# Altium schematic sheet Energy Harvesting.SchDoc
size A4; Date: 08-06-2023; Engineer: Christian Peppelman; Revision: V400; SheetNumber: 2; SheetTotal: 2; ProjectSheetName: Dental Sensor; SheetName: Energy Harvesting
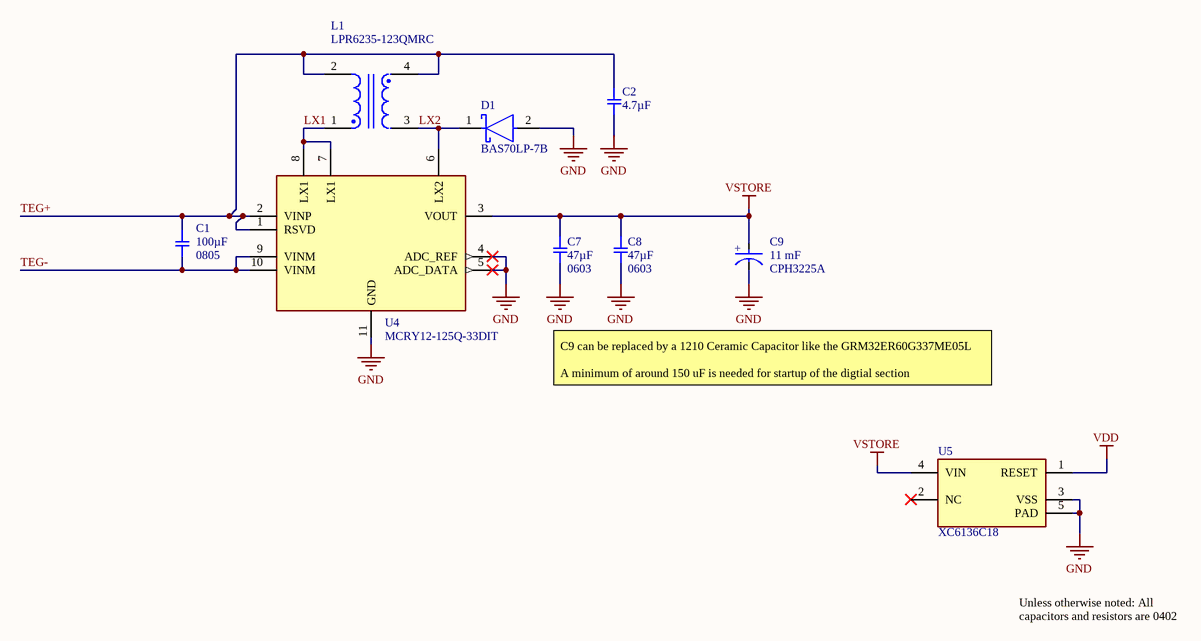
[diagram p0: Energy Harvesting.SchDoc]

## Parts
C1  100µF  Package / Case: 0805  [CAPC2012X12N]
C2  4.7µF  [RESC1005X03N]
C7  47µF  Package / Case: 0603  [CAPC1608X12N]
C8  47µF  Package / Case: 0603  [CAPC1608X12N]
C9  CPH3225A  Capacity: 11 mF  [CPH3225A]
D1  BAS70LP-7B  [FP-X1-DFN1006-2-MFG]
L1  LPR6235-123QMRC  [LPR6235]
U4  MCRY12-125Q-33DIT  [10DFN]
U5  XC6136C18  [USPQ-4B05]

## Nets
GND: C2.2 C7.2 C8.2 C9.2(A) D1.2(A) U4.4(ADC_REF) U4.5(ADC_DATA) U4.11(GND) U5.3(VSS) U5.5(PAD)
VDD: U5.1(RESET)
VSTORE: C7.1 C8.1 C9.1(C) U4.3(VOUT) U5.4(VIN)
LX1: L1.1 U4.7(LX1) U4.8(LX1)
LX2: D1.1(C) L1.3 U4.6(LX2)
TEG+: C1.1 C2.1 L1.2 L1.4 U4.1(RSVD) U4.2(VINP)
TEG-: C1.2 U4.9(VINM) U4.10(VINM)

Not connected (* = marked no-connect by the designer): U5 2(NC)*

## Notes on the sheet
- C9 can be replaced by a 1210 Ceramic Capacitor like the GRM32ER60G337ME05L
  A minimum of around 150 uF is needed for startup of the digtial section
- Unless otherwise noted: All capacitors and resistors are 0402
- Embedded and
- Networked System
- ENGINEER:
- DATE:
- REVISION:
- SIZE: A4
- (in symbol CPH3225A) +

## Library data of the parts
C1 = GRM21BC80E107ME15L: CAP CER 100UF 2.5V X6S 0805; Manufacturer: Murata Electronics North America; Factory Stock: 0; Unit Price (USD): 2.17; Minimum Quantity: 1; Tolerance: ±20%; Datasheets: http://search.murata.co.jp/Ceramy/image/img/A01X/G101/ENG/GRM21BC80E107ME15-01.pdf; Image: //media.digikey.com/Renders/Murata%20Renders/0805%20(2012%20Metric)%20.85mm.jpg; Digi-Key Part Number: 490-13977-1-ND; Part Number: GRM21BC80E107ME15L; Quantity Available: 5990; @ qty: 0; Packaging: Cut Tape (CT); Series: GRM; Part Status: Active; Value: 100µF; Voltage: 2.5V; Temperature Coefficient: X6S; Operating Temperature: -55°C ~ 105°C; Features: -; Ratings: -; Applications: General Purpose; Mounting Type: Surface Mount, MLCC; Size / Dimension: 0.079" L x 0.049" W (2.00mm x 1.25mm); Height - Seated (Max): -; Thickness (Max): 0.057" (1.45mm); Lead Spacing: -; Lead Style: -
C2 = GRM155R60J475ME87D: CAP CER 4.7UF 6.3V X5R 0402; Manufacturer: Murata Electronics North America; Factory Stock: 0; Unit Price (USD): 0.14; Minimum Quantity: 1; Tolerance: ±20%; Datasheets: http://www.murata.com/~/media/webrenewal/support/library/catalog/products/capacitor/mlcc/c02e.pdf; Image: //media.digikey.com/Renders/Murata%20Renders/ZRB-SERIES-0402.jpg; Digi-Key Part Number: 490-5408-1-ND; Part Number: GRM155R60J475ME87D; Quantity Available: 226483; @ qty: 0; Packaging: Cut Tape (CT); Series: GRM; Part Status: Active; Value: 4.7µF; Voltage: 6.3V; Temperature Coefficient: X5R; Operating Temperature: -55°C ~ 85°C; Features: Derating Recommended; Ratings: -; Applications: General Purpose; Mounting Type: Surface Mount, MLCC; Package / Case: 0402 (1005 Metric); Size / Dimension: 0.039" L x 0.020" W (1.00mm x 0.50mm); Height - Seated (Max): -; Thickness (Max): 0.022" (0.55mm); Lead Spacing: -; Lead Style: -
C7 C8 = GRJ155R60J106ME11D: CAP CER 47UF 6.3V X5R 0603; Manufacturer: Murata Electronics North America; Factory Stock: 0; Unit Price (USD): 0.23; Minimum Quantity: 1; Tolerance: ±20%; Datasheets: http://psearch.en.murata.com/capacitor/product/GRJ155R60J106ME11%23.pdf; Image: //media.digikey.com/Renders/Murata%20Renders/ZRB-SERIES-0402.jpg; Digi-Key Part Number: 490-13211-1-ND; Part Number: GRJ155R60J106ME11D; Quantity Available: 64064; @ qty: 0; Packaging: Cut Tape (CT); Series: GRJ; Part Status: Active; Value: 47µF; Voltage: 6.3V; Temperature Coefficient: X5R; Operating Temperature: -55°C ~ 85°C; Features: Derating Recommended, Soft Termination; Ratings: -; Applications: Boardflex Sensitive; Mounting Type: Surface Mount, MLCC; Size / Dimension: 0.039" L x 0.020" W (1.00mm x 0.50mm); Height - Seated (Max): -; Thickness (Max): 0.028" (0.70mm); Lead Spacing: -; Lead Style: -
C9 = CPH3225A: Supercapacitors / Ultracapacitors Reflow EDLC 3.3V, 11mF, 160 Ohm
D1 = CMP-12790-000002-1: DIODE SCHTTKY 70V 70MA X1DFN1006; Manufacturer: Diodes Inc.; Max Surge Forward Current: 800mA; Capacitance: 1pF; Value: 1pF; Max Junction Temp: +150°C; Standoff Height: 0mm; Peak Reverse Current: 0.1uA; Temperature: -65°C to +150°C; Temperature Range High: +150°C; Automotive: No; Category: Diode; Max Repetitive Reverse Voltage: 70V; Digikey Description: DIODE SCHTTKY 70V 70MA X1DFN1006; Device Class L1: Discrete Semiconductors; Lead Free: Yes; Footprint Url: https://www.diodes.com/assets/Package-Files/X1-DFN1006-2.pdf; Temperature Range Low: -65°C; Reverse Voltage: 70V; Forward Current: 70mA; Package: X1-DFN1006-2; RoHS: TRUE; Manufacturer Part Number: BAS70LP-7B; Height: 0.53mm; Octopart: https://octopart.com/bas70lp-7b-diodes+inc.-22053921; Device Class L3: Schottky Diodes; ComponentLink2URL: https://www.diodes.com/assets/Datasheets/BAS70LP.pdf; ComponentLink2Description: Datasheet; Mouser Description: Schottky Diodes & Rectifiers Schottky Diode; Device Class L2: Diodes
L1 = LPR6235-123QMRC: Gekoppelde smoorspoelen 12.5uH 12% 900mA 200 Ohms
U4 = MCRY12: Matrix Mercury Energy Harvesting Synchronous Boost Converter with Microwatt Cold-Start, Input Impedance Matching and Regulated Output
U5 = XC6136N18A9R-G: Controlecircuits Ultra-Low Power (88nA) Voltage Detector